# EAGLE design Schematic_nobuttons_noserial (EAGLE 8.2.2)
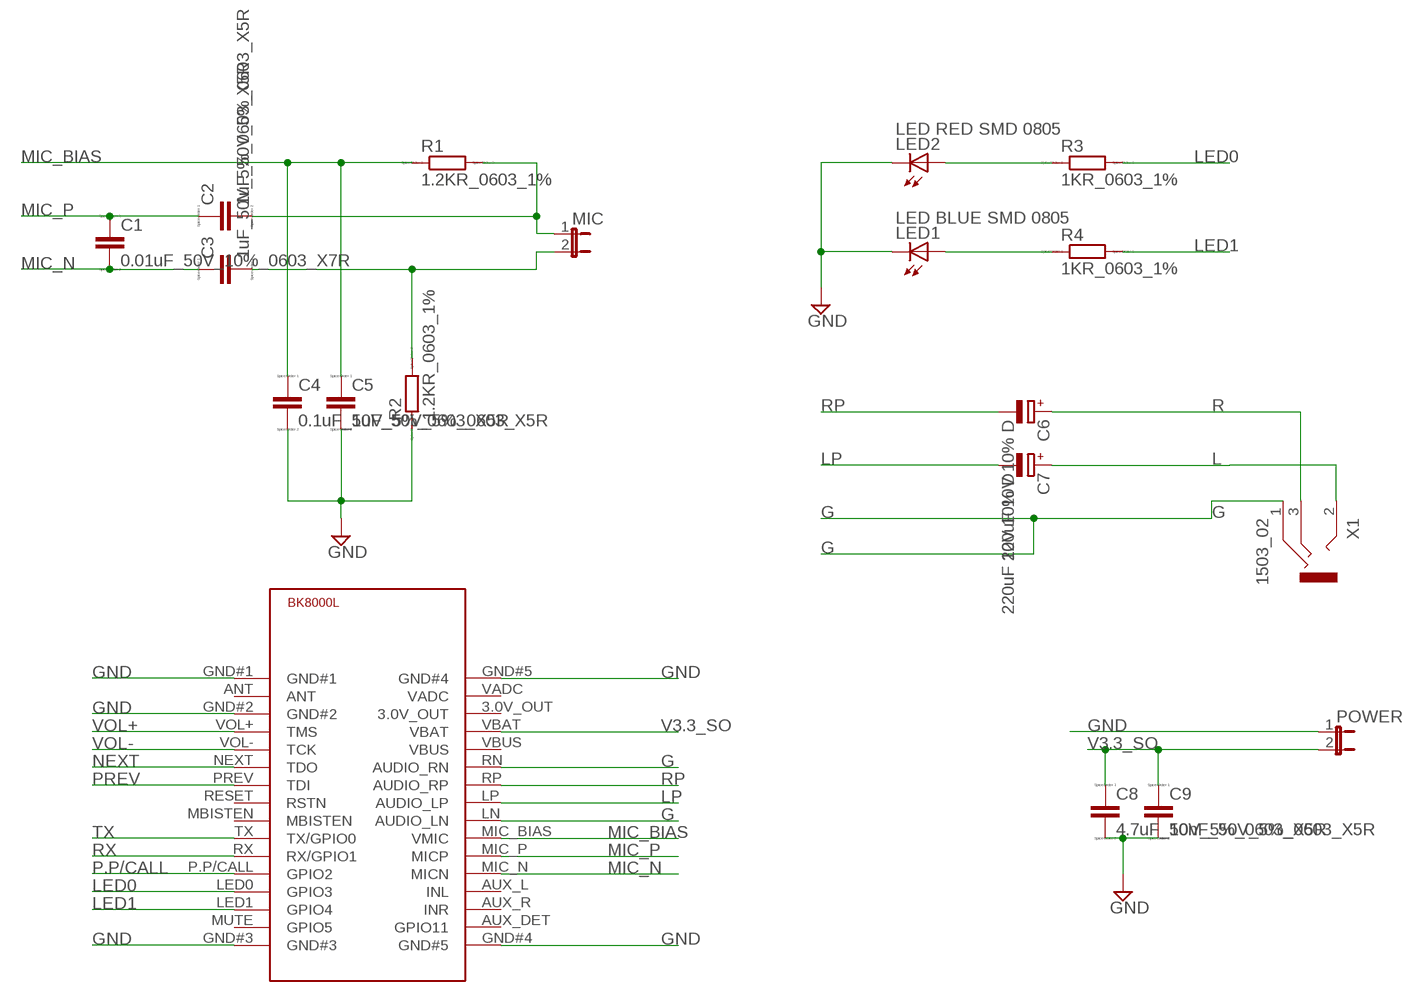
[diagram p0: schematic, sheet 1]

## Parts
C1  0.01uF_50V_10%_0603_X7R  CC0603  [C0603]
C2  1uF_50V_5%_0603_X5R  CC0603  [C0603]
C3  1uF_50V_5%_0603_X5R  CC0603  [C0603]
C4  0.1uF_50V_5%_0603_X5R  CC0603  [C0603]
C5  1uF_50V_5%_0603_X5R  CC0603  [C0603]
C6  220uF 10V 10% D  CPOL-EUSMCD  [SMC_D]
C7  220uF 10V 10% D  CPOL-EUSMCD  [SMC_D]
C8  4.7uF_50V_5%_0603_X5R  CC0603  [C0603]
C9  10nF_50V_5%_0603_X5R  CC0603  [C0603]
LED1  LED BLUE SMD 0805  LEDCHIP-LED0805  [CHIP-LED0805]
LED2  LED RED SMD 0805  LEDCHIP-LED0805  [CHIP-LED0805]
MIC  JP1E  [JP1]
POWER  JP1E  [JP1]
R1  1.2KR_0603_1%  RR0603  [R0603]
R2  1.2KR_0603_1%  RR0603  [R0603]
R3  1KR_0603_1%  RR0603  [R0603]
R4  1KR_0603_1%  RR0603  [R0603]
U$1  BK8000LBK8000L_PAD  [BK8000L]
X1  1503_02  [1503_02]

## Nets
G: U$1.LN(AUDIO_LN) U$1.RN(AUDIO_RN) X1.1
GND: C4.2 C5.2 C8.2 C9.2 LED1.C LED2.C POWER.1 R2.1 U$1.GND#1 U$1.GND#2 U$1.GND#3 U$1.GND#4(GND#5) U$1.GND#5(GND#4)
L: C7.+ X1.2
LED0: R3.2 U$1.LED0(GPIO3)
LED1: R4.2 U$1.LED1(GPIO4)
LP: C7.- U$1.LP(AUDIO_LP)
MIC_BIAS: C4.1 C5.1 R1.1 U$1.MIC_BIAS(VMIC)
MIC_N: C1.2 C3.1 U$1.MIC_N(MICN)
MIC_P: C1.1 C2.1 U$1.MIC_P(MICP)
N$1: LED1.A R4.1
N$2: LED2.A R3.1
N$6: C3.2 MIC.2 R2.2
N$7: C2.2 MIC.1 R1.2
NEXT: U$1.NEXT(TDO)
P.P/CALL: U$1.P.P/CALL(GPIO2)
PREV: U$1.PREV(TDI)
R: C6.+ X1.3
RP: C6.- U$1.RP(AUDIO_RP)
RX: U$1.RX(RX/GPIO1)
TX: U$1.TX(TX/GPIO0)
V3.3_SO: C8.1 C9.1 POWER.2 U$1.VBAT
VOL+: U$1.VOL+(TMS)
VOL-: U$1.VOL-(TCK)
Unconnected: U$1.3.0V_OUT U$1.ANT U$1.AUX_DET(GPIO11) U$1.AUX_L(INL) U$1.AUX_R(INR) U$1.MBISTEN U$1.MUTE(GPIO5) U$1.RESET(RSTN) U$1.VADC U$1.VBUS X1.2@2

## Library data of the parts
C1-C5 C8 C9 = eagle-ltspice:C: CAPACITOR, European symbol; SPICEMODEL: NONE; SPICEPREFIX: C
C6 C7 = resistor:CPOL-EU: POLARIZED CAPACITOR, European symbol
LED1 LED2 = led:LED: LED OSRAM: - CHIPLED LG R971, LG N971, LY N971, LG Q971, LY Q971, LO R971, LY R971 LH N974, LH R974 LS Q976, LO Q976, LY Q976 LO Q996 - Hyper CHIPLED LW Q18S LB Q993, LB Q99A, LB R99A - SideLED LS A670, LO A670, LY A670, LG A670, LP A670 LB A673, LV A673, LT A673, LW A673 LH A674 LY A675 LS A676, LA A676, LO A676, LY A676, LW A676 LS A679, LY A679, LG A679 - Hyper Micro SIDELED® LS Y876, LA Y876, LO Y876, LY Y876 LT Y87S - SmartLED LW L88C, LW L88S LB L89C, LB L89S, LG L890 LS L89K, LO L89K, LY L89K LS L896, LA L896, LO L896, LY L896 - TOPLED LS T670, LO T670, LY T670, LG T670, LP T670 LSG T670, LSP T670, LSY T670, LOP T670, LYG T670 LG T671, LOG T671, LSG T671 LB T673, LV T673, LT T673, LW T673 LH T674 LS T676, LA T676, LO T676, LY T676, LB T676, LH T676, LSB T676, LW T676 LB T67C, LV T67C, LT T67C, LS T67K, LO T67K, LY T67K, LW E67C LS E67B, LA E67B, LO E67B, LY E67B, LB E67C, LV E67C, LT E67C LW T67C LS T679, LY T679, LG T679 LS T770, LO T770, LY T770, LG T770, LP T770 LB T773, LV T773, LT T773, LW T773 LH T774 LS E675, LA E675, LY E675, LS T675 LS T776, LA T776, LO T776, LY T776, LB T776 LHGB T686 LT T68C, LB T68C - Hyper Mini TOPLED® LB M676 - Mini TOPLED Santana® LG M470 LS M47K, LO M47K, LY M47K Source: http://www.osram.convergy.de LUXEON: - LUMILED® LXK2-PW12-R00, LXK2-PW12-S00, LXK2-PW14-U00, LXK2-PW14-V00 LXK2-PM12-R00, LXK2-PM12-S00, LXK2-PM14-U00 LXK2-PE12-Q00, LXK2-PE12-R00, LXK2-PE12-S00, LXK2-PE14-T00, LXK2-PE14-U00 LXK2-PB12-K00, LXK2-PB12-L00, LXK2-PB12-M00, LXK2-PB14-N00, LXK2-PB14-P00, LXK2-PB14-Q00 LXK2-PR12-L00, LXK2-PR12-M00, LXK2-PR14-Q00, LXK2-PR14-R00 LXK2-PD12-Q00, LXK2-PD12-R00, LXK2-PD12-S00 LXK2-PH12-R00, LXK2-PH12-S00 LXK2-PL12-P00, LXK2-PL12-Q00, LXK2-PL12-R00 Source: www.luxeon.com KINGBRIGHT: KA-3528ASYC Source: www.kingbright.com
MIC POWER = jumper:JP1E: JUMPER
R1-R4 = eagle-ltspice:R: RESISTOR, European symbol; SPICEMODEL: NONE; SPICEPREFIX: R
U$1 = BK8000L:BK8000L: BK8000L Bluetooth Audio module.
X1 = con-lumberg:1503_02: Jack connectors according to JISC 6560, 3.5 mm Klinkeneinbaukupplung nach JISC 6560, 3,5 mm, 3-polig/stereo, abgewinkelte Ausführung, Surface-Mount-Technik (SMT) Source: http://www.lumberg.com/Produkte/PDFs/1503_02.pdf; OC_FARNELL: 1216979; OC_NEWARK: unknown

## Board
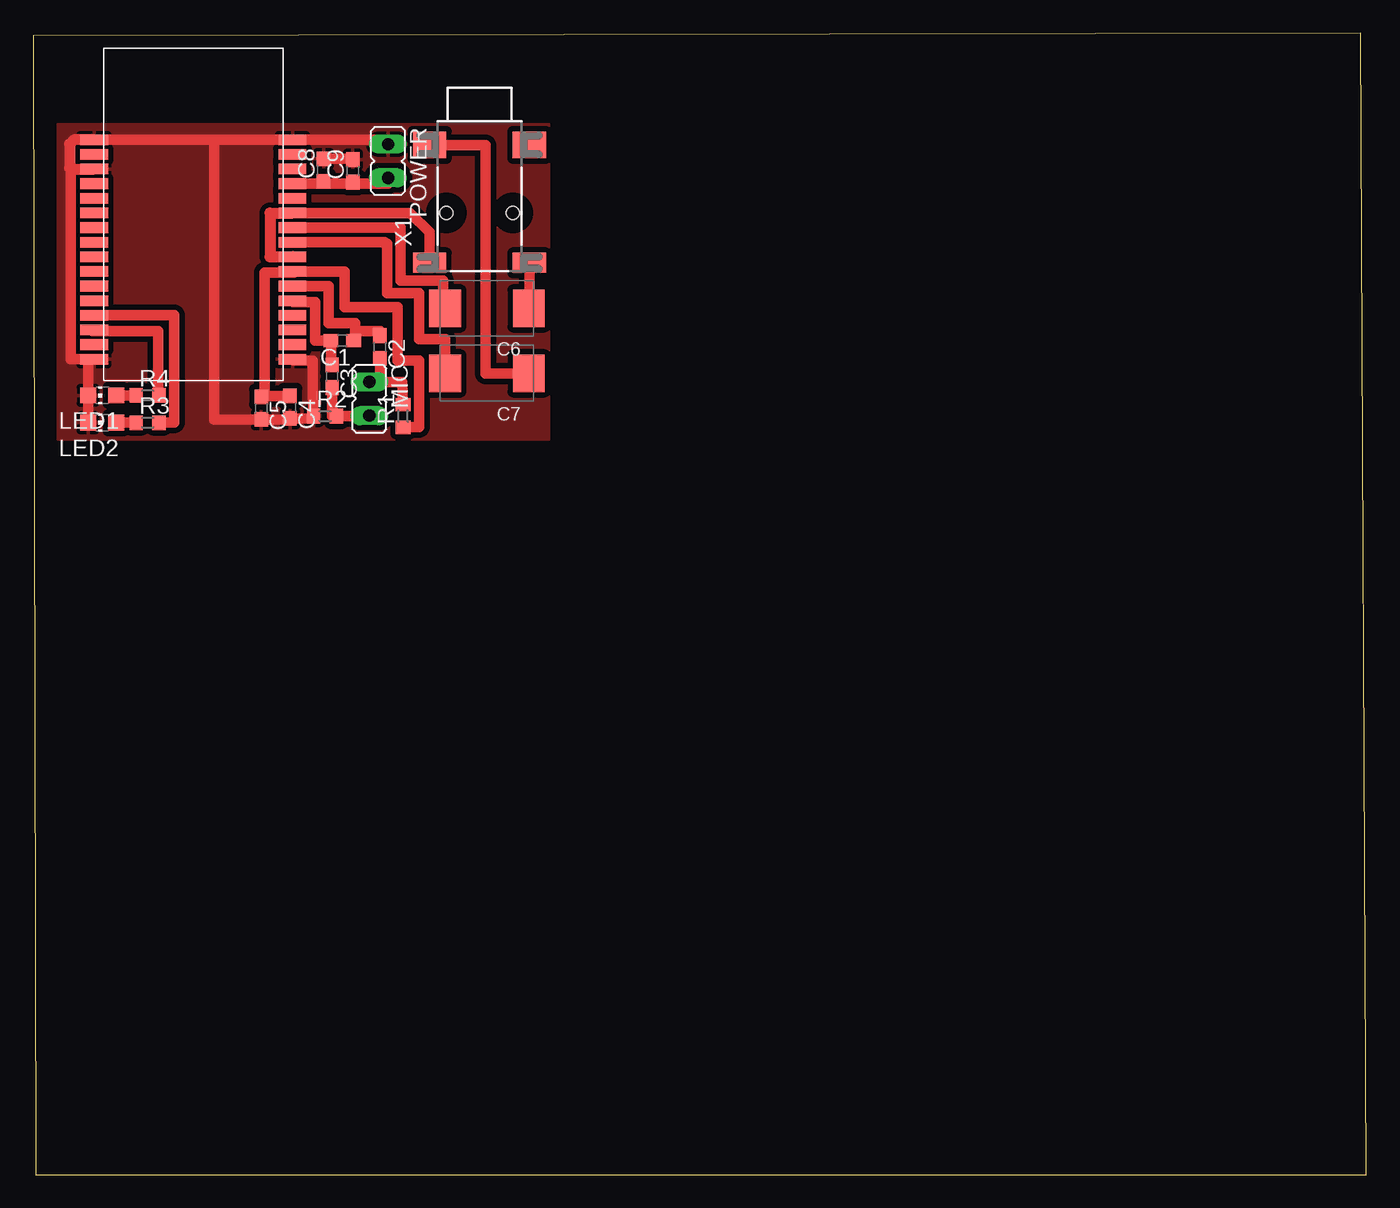
[diagram p1: board, top side]

Size 100.2 x 85.8 mm. Coordinates in mm from the lower left corner, seen from the top.
Outline: 0.2,0 100.2,0 99.8,85.8 0,85.6 0.2,0
Copper layers (1*16): Top 0.035mm / dielectric 1.5mm / Bottom 0.035mm
Design rules "default": minimum track width 6mil, minimum drill 0.35mm, track to track 6mil, track to pad 6mil, pad to pad 6mil, via to via 6mil, smd to smd 6mil, copper to edge 40mil, drill to drill 6mil, minimum pad ring 10mil, minimum via ring 8mil, stop-mask expansion 4mil, vias tented up to drill 0mil, thermal gap 10mil

### Footprints (pad centres in the part's own frame; a part is rotated, then mirrored left to right if it is on the bottom)
C0603 = smd 1.1 x 1: 1 -0.85,0; 2 0.85,0
SMC_D = smd 2.4 x 2.8: + -3.15,0; - 3.15,0
CHIP-LED0805 = smd 1.2 x 1.2: A 0,-1.05; C 0,1.05
JP1 = drill 0.914 long: 1 0,-1.27; 2 0,1.27
R0603 = smd 1 x 1.1: 1 -0.85,0; 2 0.85,0
BK8000L = smd 2.1 x 0.8: 3.0V_OUT 14.2,15.9; ANT -0.7,17; AUX_DET 14.2,2.7; AUX_L 14.2,4.9; AUX_R 14.2,3.8; GND#1 -0.7,18.1; GND#2 -0.7,15.9; GND#3 -0.7,1.6; GND#4 14.2,1.6; GND#5 14.2,18.1; LED0 -0.7,4.9; LED1 -0.7,3.8; LN 14.2,9.3; LP 14.2,10.4; MBISTEN -0.7,9.3; MIC_BIAS 14.2,8.2; MIC_N 14.2,6; MIC_P 14.2,7.1; MUTE -0.7,2.7; NEXT -0.7,12.6; P.P/CALL -0.7,6; PREV -0.7,11.5; RESET -0.7,10.4; RN 14.2,12.6; RP 14.2,11.5; RX -0.7,7.1; TX -0.7,8.2; VADC 14.2,17; VBAT 14.2,14.8; VBUS 14.2,13.7; VOL+ -0.7,14.8; VOL- -0.7,13.7
1503_02 = smd 2.5 x 1.5: 1 -3.75,-10.75; 3 3.75,-10.75 | smd 2.5 x 2: 2 -3.75,-1.9; 2@2 3.75,-1.9 | hole 1: -2.5,-7; 2.5,-7

### Placement (x,y rotation side)
C1  23.23,62.7 180 top
C2  26.06,62.22 270 top
C3  22.46,60.01 270 top
C4  19.3,57.69 270 top
C5  17.14,57.62 270 top
C6  34.1,65.12 180 top
C7  34.1,60.24 180 top
C8  21.82,75.51 90 top
C9  24.02,75.45 90 top
LED1  5.18,58.58 90 top
LED2  5.18,56.52 90 top
MIC  25.27,58.32 180 top
POWER  26.67,76.2 180 top
R1  27.8,57.03 90 top
R2  21.93,57.02 0 top
R3  8.59,56.52 0 top
R4  8.59,58.58 0 top
U$1  5.28,59.69 0 top
X1  33.54,79.3 0 top

### Tracks (layer width: path | path; a pad name or v marks a point on that pad's centre or on a via)
G
  Top 0.8: X1.1 29.79,70.84 28.34,72.29 U$1.RN
  Top 0.813: U$1.RN 17.8,72.29 17.8,69 19.58,69 U$1.LN
GND
  Top 0.8: U$1.GND#4 19.58,61.2 21,61.2 21,58.62 R2.1 21.08,56.84 C4.2 19.3,56.77 C5.2 13.6,56.77 13.6,77.79 | LED2.C LED1.C 4.13,61.29 U$1.GND#3 2.8,61.29 2.8,75.6 | 13.6,77.79 U$1.GND#5 26.67,77.79 POWER.1 | 13.6,77.79 U$1.GND#1 | C8.2 24.02,76.36 C9.2
  Top 0.813: U$1.GND#1 3.06,77.79 2.74,77.47 2.74,75.66 2.8,75.6 4.47,75.6 U$1.GND#2
  pour Top (isolate 0.406): 1.8,79 38.8,79 38.8,55.2 1.8,55.2
L
  Top 0.8: C7.+ 37.25,60.2 34,60.2 34,77.4 X1.2
LED0
  Top 0.8: R3.2 10.6,56.52 10.6,64.6 4.48,64.6 U$1.LED0
LED1
  Top 0.8: R4.2 9.4,58.58 9.4,63.4 4.48,63.4 U$1.LED1
LP
  Top 0.8: U$1.LP 26.4,70.09 26.4,70 26.6,70 26.6,66.4 26.65,66.4 26.61,66.25 29,66.25 29,62.8 30.95,62.8 C7.-
MIC_BIAS
  Top 0.8: C4.1 17.14,58.54 C5.1 17.4,58.47 17.4,67.8 19.58,67.8 U$1.MIC_BIAS 23.4,67.89 23.4,65.2 27.4,65.2 27.4,61.2 29,61.2 29,56.2 R1.1
MIC_N
  Top 0.8: C3.1 22.38,60.86 C1.2 21.2,62.7 21.2,65.6 19.58,65.6 U$1.MIC_N
MIC_P
  Top 0.8: C1.1 24.2,62.7 24.2,63.4 | U$1.MIC_P 19.58,66.8 22.2,66.8 22.2,64 24.2,64 24.2,63.4 | 24.2,63.4 26.06,63.4 C2.1
N$1
  Top 0.8: LED1.A R4.1
N$2
  Top 0.8: LED2.A R3.1
N$6
  Top 0.8: MIC.2 25.27,57.02 R2.2 22.46,57.02 C3.2
N$7
  Top 0.8: R1.2 27.72,59.59 MIC.1 26.06,59.59 C2.2
R
  Top 0.8: C6.+ 37.29,65.12 X1.3
RP
  Top 0.8: C6.- 30.8,65.12 30.8,67.2 27.6,67.2 27.6,71.2 19.58,71.2 U$1.RP
V3.3_SO
  Top 0.8: 22,74.49 U$1.VBAT | 23.95,74.49 22,74.49 | 23.95,74.49 26.67,74.49 POWER.2 | C8.1 22,74.66 22,74.49 | C9.1 23.95,74.6 23.95,74.49